# Altium schematic sheet 2_Fuente.SchDoc
size A4; SheetNumber: 2; SheetTotal: 3
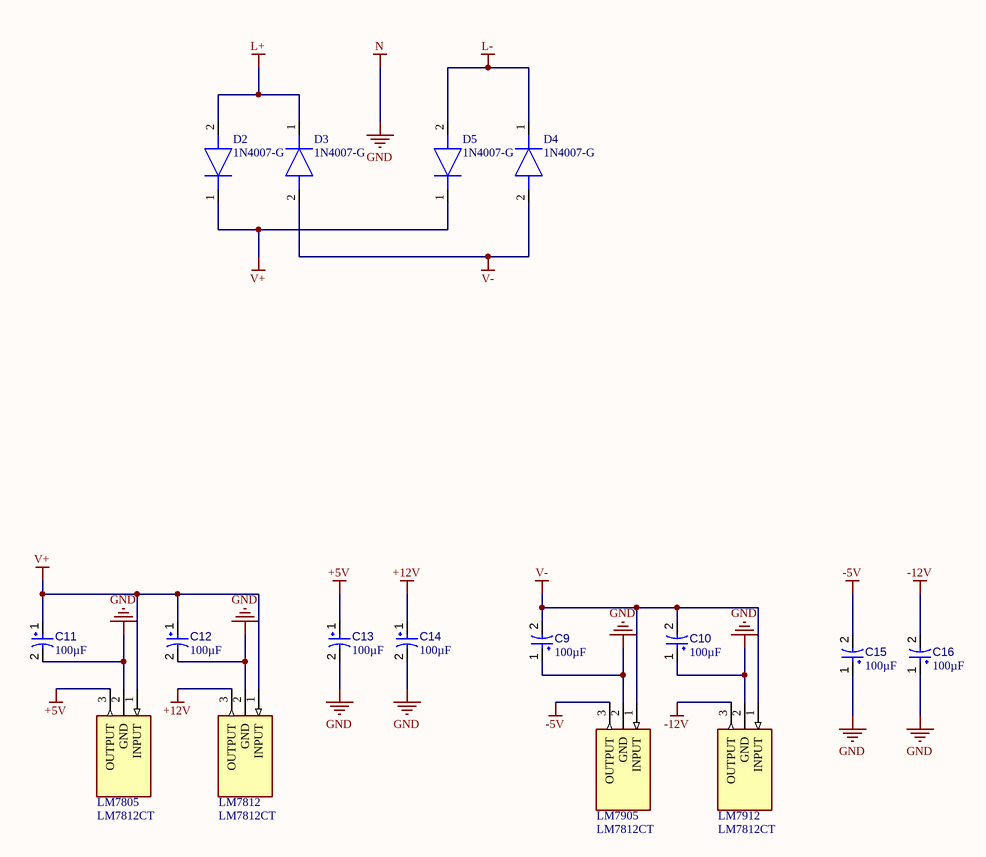
[diagram p0: 2_Fuente.SchDoc]

## Parts
C9  value 100µF  [CAPPR55-200-1100X500X1200]  (hidden comment: ECA1HM100)
C10  value 100µF  [CAPPR55-200-1100X500X1200]  (hidden comment: ECA1HM100)
C11  value 100µF  [CAPPR55-200-1100X500X1200]  (hidden comment: ECA1HM100)
C12  value 100µF  [CAPPR55-200-1100X500X1200]  (hidden comment: ECA1HM100)
C13  value 100µF  [CAPPR55-200-1100X500X1200]  (hidden comment: ECA1HM100)
C14  value 100µF  [CAPPR55-200-1100X500X1200]  (hidden comment: ECA1HM100)
C15  value 100µF  [CAPPR55-200-1100X500X1200]  (hidden comment: ECA1HM100)
C16  value 100µF  [CAPPR55-200-1100X500X1200]  (hidden comment: ECA1HM100)
D2  1N4007-G  [DIOAD1410W90L470D235]
D3  1N4007-G  [DIOAD1410W90L470D235]
D4  1N4007-G  [DIOAD1410W90L470D235]
D5  1N4007-G  [DIOAD1410W90L470D235]
LM7805  LM7812CT  [TO254P470X1028X1955-3P]
LM7812  LM7812CT  [TO254P470X1028X1955-3P]
LM7905  LM7812CT  [TO254P470X1028X1955-3P]
LM7912  LM7812CT  [TO254P470X1028X1955-3P]

## Nets
+5V: C13.1 LM7805.3(OUTPUT)
+12V: C14.1 LM7812.3(OUTPUT)
-5V: C15.2 LM7905.3(OUTPUT)
-12V: C16.2 LM7912.3(OUTPUT)
GND: C9.1 C10.1 C11.2 C12.2 C13.2 C14.2 C15.1 C16.1 LM7805.2(GND) LM7812.2(GND) LM7905.2(GND) LM7912.2(GND)  [also labelled N]
L+: D2.2(A) D3.1(K)
L-: D4.1(K) D5.2(A)
V+: C11.1 C12.1 D2.1(K) D5.1(K) LM7805.1(INPUT) LM7812.1(INPUT)
V-: C9.2 C10.2 D3.2(A) D4.2(A) LM7905.1(INPUT) LM7912.1(INPUT)

## Library data of the parts
C9-C16 = CMP-001-00025-7: Aluminum Electrolytic Capacitor, 10 uF, +/- 20%, 50 V, -40 to 85 degC, 2-Pin THD, RoHS, Bulk; Manufacturer: Panasonic; Ripple Current (AC): 65mA; Voltage Rating: 50V; Mounting Technology: TH; RoHS Compliant: True; Capacitor Type: Electrolytic; Datasheet Version: Rev. 05, 10/2016; Min Operating Temperature: -40°C; Packaging: Bulk; Ripple Current: 65mA; Tolerance: 20%; Max Operating Temperature: 85°C; Datasheet URL: https://industrial.panasonic.com/cdbs/www-data/pdf/RDF0000/ABA0000C1218.pdf; Lead Pitch: 2mm; Pins: 2; Diameter: 5mm; Manufacturer URL: http://www.panasonic.com/; Package Reference: CAPPR55-200-1100X500X1200; Package Description: 2-Pin Radial Lead, Dia 5 mm, Height 12 mm; Case/Package: Radial; Package Quantity: 200
D2-D5 = 1N4007-G: Diode; Manufacturer_Name: Comchip Technology; Datasheet Link: https://datasheet.datasheetarchive.com/originals/distributors/Datasheets-DGA23/1390217.pdf; Manufacturer_Part_Number: 1N4007-G; Mouser Part Number: 750-1N4007-G; Mouser Price/Stock: https://www.mouser.co.uk/ProductDetail/Comchip-Technology/1N4007-G?qs=2qJf6qQ4IOKzApuByvlhjQ%3D%3D; Arrow Part Number: 1N4007-G; Arrow Price/Stock: https://www.arrow.com/en/products/1n4007-g/comchip-technology?region=nac
LM7805 LM7812 LM7905 LM7912 = LM7812CT: Integrated Circuit; Manufacturer_Name: Texas Instruments; Datasheet Link: http://www.ti.com/lit/ds/symlink/lm7800.pdf; Height: 4.7mm; Manufacturer_Part_Number: LM7812CT; Mouser Part Number: 926-LM7812CT; Mouser Price/Stock: https://www.mouser.co.uk/ProductDetail/Texas-Instruments/LM7812CT?qs=QbsRYf82W3EQj7KGft8TFg%3D%3D